# Altium project ByteBlaster II.PrjPcb
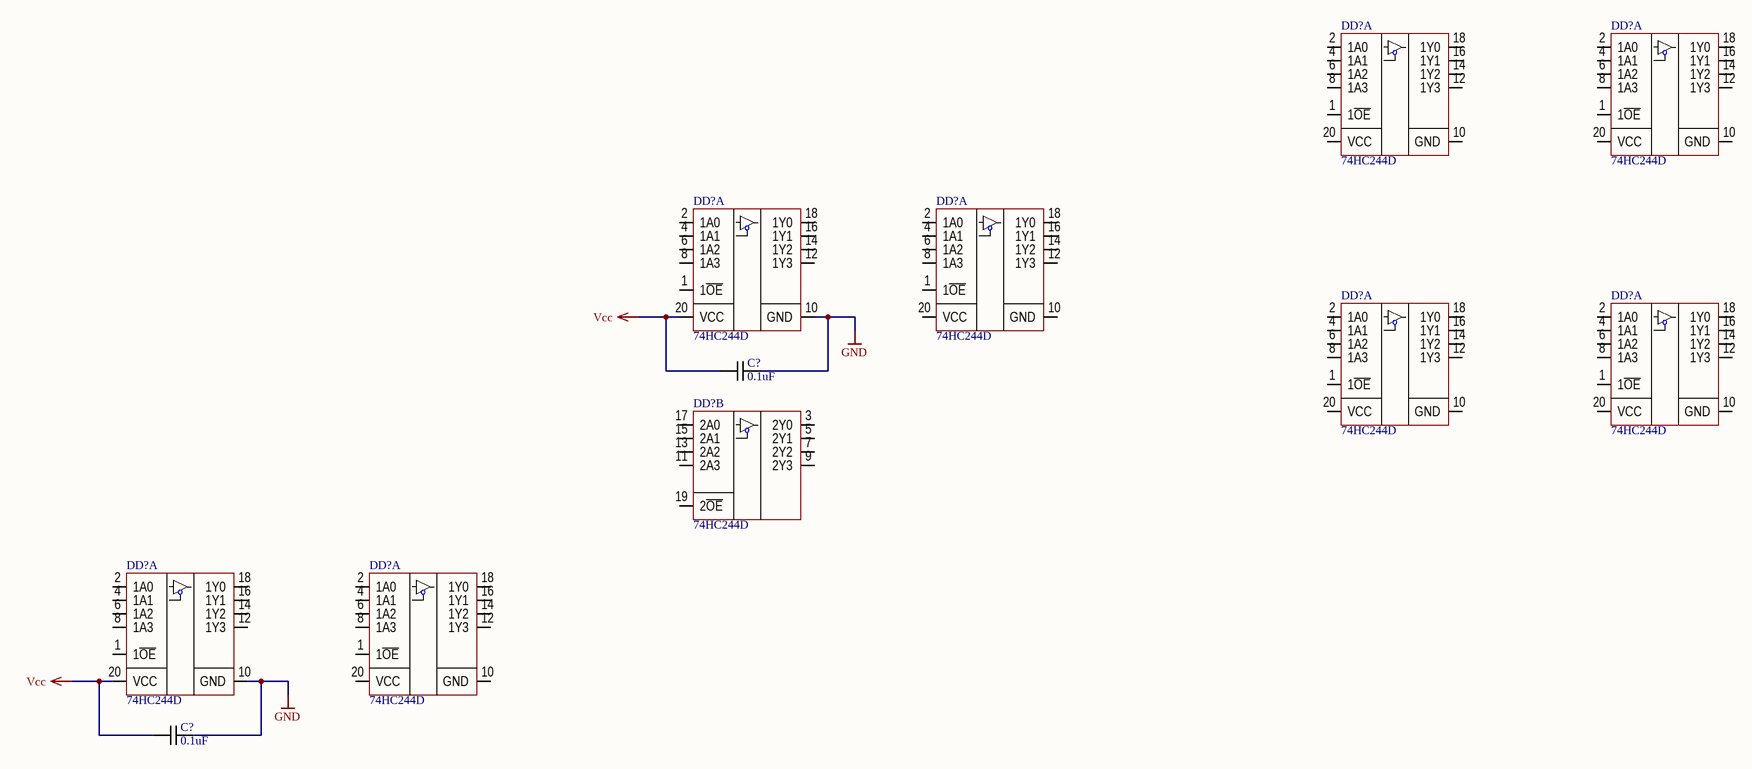
[diagram p0: ByteBlaster II.SchDoc]
1 sheet, 11 parts. Net scope: global (net labels, ports and power ports of the same name join across sheets).
Board file: ByteBlaster II.PcbDoc

## Sheet ByteBlaster II.SchDoc
size 420 x 297 mm; Address1: Address1; Address2: Address2; Address3: Address3; Address4: Address4; DocumentNumber: CPAE 525.1 XXX YY E3; SheetNumber: 1; Scale: 1:1; FirstReferrence: CPAE 525.1 XXX YY; PageSetup: Record=PageOptions|CenterHorizontal=True|CenterVertical=True|PrintScale=0.67|XCorrection=1.00|YCorrection=1.00|PrintKind=1|BorderSize=5000000|LeftOffset=0|BottomOffset=0|Orientation=2|PaperLength=1000|PaperWidth=1000|Scale=100|PaperSource=1|PrintQuality=600|MediaType=1|DitherType=10|PrintScaleMode=1|PaperKind=A4|PaperIndex=9

### Parts
(Parts that share a designator on the sheet are numbered #1, #2 ... from top to bottom, then left to right.)
C?#1  0.1uF  [CAPC2012(0805)N]
C?#2  0.1uF  [CAPC2012(0805)N]
DD?#1  74HC244D  [SOIC-SO20_L]  (part A of 2)
DD?#2  74HC244D  [SOIC-SO20_L]  (part A of 2)
DD?#3  74HC244D  [SOIC-SO20_L]  (part A of 2)
DD?#4  74HC244D  [SOIC-SO20_L]  (part A of 2)
DD?#5  74HC244D  [SOIC-SO20_L]  (part A of 2)
DD?#6  74HC244D  [SOIC-SO20_L]  (part A of 2)
DD?#7  74HC244D  [SOIC-SO20_L]  (part B of 2)
DD?#8  74HC244D  [SOIC-SO20_L]  (part A of 2)
DD?#9  74HC244D  [SOIC-SO20_L]  (part A of 2)

### Nets
GND: C?#1.2 C?#2.2 DD?#3.10(GND) DD?#8.10(GND)
Vcc: C?#1.1 C?#2.1 DD?#3.20(VCC) DD?#8.20(VCC)

Not connected (* = marked no-connect by the designer): DD?#1 1(1~{OE}) 2(1A0) 4(1A1) 6(1A2) 8(1A3) 10(GND) 12(1Y3) 14(1Y2) 16(1Y1) 18(1Y0) 20(VCC); DD?#2 1(1~{OE}) 2(1A0) 4(1A1) 6(1A2) 8(1A3) 10(GND) 12(1Y3) 14(1Y2) 16(1Y1) 18(1Y0) 20(VCC); DD?#3 1(1~{OE}) 2(1A0) 4(1A1) 6(1A2) 8(1A3) 12(1Y3) 14(1Y2) 16(1Y1) 18(1Y0); DD?#4 1(1~{OE}) 2(1A0) 4(1A1) 6(1A2) 8(1A3) 10(GND) 12(1Y3) 14(1Y2) 16(1Y1) 18(1Y0) 20(VCC); DD?#5 1(1~{OE}) 2(1A0) 4(1A1) 6(1A2) 8(1A3) 10(GND) 12(1Y3) 14(1Y2) 16(1Y1) 18(1Y0) 20(VCC); DD?#6 1(1~{OE}) 2(1A0) 4(1A1) 6(1A2) 8(1A3) 10(GND) 12(1Y3) 14(1Y2) 16(1Y1) 18(1Y0) 20(VCC); DD?#7 3(2Y0) 5(2Y1) 7(2Y2) 9(2Y3) 11(2A3) 13(2A2) 15(2A1) 17(2A0) 19(2~{OE}); DD?#8 1(1~{OE}) 2(1A0) 4(1A1) 6(1A2) 8(1A3) 12(1Y3) 14(1Y2) 16(1Y1) 18(1Y0); DD?#9 1(1~{OE}) 2(1A0) 4(1A1) 6(1A2) 8(1A3) 10(GND) 12(1Y3) 14(1Y2) 16(1Y1) 18(1Y0) 20(VCC)

### Notes on the sheet
- Elaborat.
- Mod
- Coala
- Nr. document
- Semnat
- Data
- Litera
- Masa
- Scara
- Controlat
- T.contr.
- Coli
- Abrobat
- N.contr.

### Library data of the parts
C?#1 C?#2 = CAPCC2012[0805]: Part Number: CAPCC2012[0805]
DD?#1-DD?#9 = 74HC244D: Part Number: 74HC244D; HelpURL: http://www.nxp.com/documents/data_sheet/74HC_HCT244.pdf